# EAGLE design M0FeatherSIC (EAGLE 6.5.0)
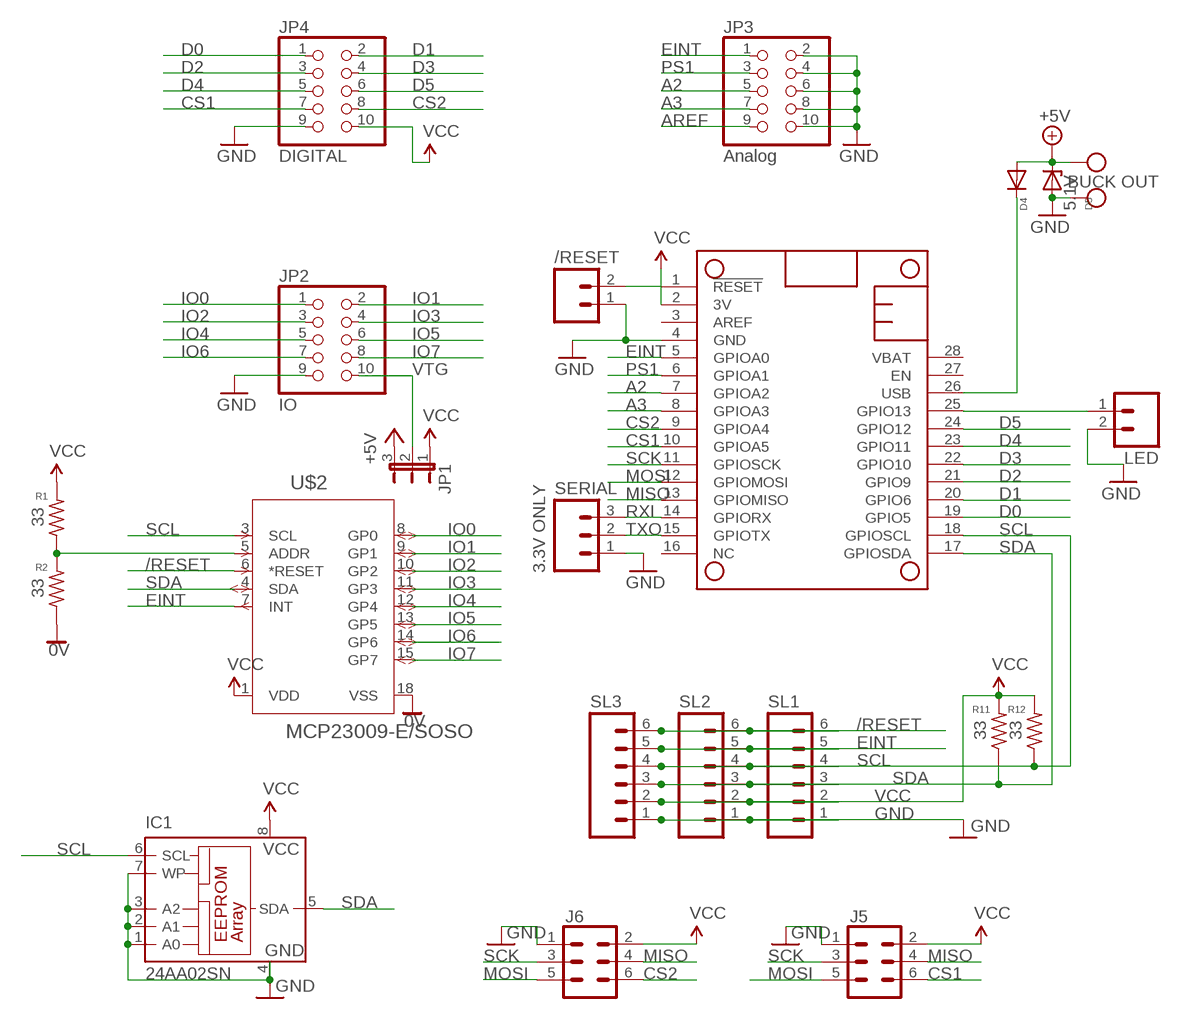
[diagram p0: schematic, sheet 1]

## Parts
/RESET  M02  [02P]
BUCK-OUT  BUCK OUT  W237-102  [W237-102]
D4  1N4148DO35-7  [DO35-7]
D5  5.1V  ZENER-DIODEZD-7.5  [ZDIO-7.5]
IC1  24AA02SN  [SO-08]
J5  CONN_03X2SHROUD  [2X3-SHROUDED]
J6  CONN_03X2SHROUD  [2X3-SHROUDED]
JP1  JP2E  [JP2]
JP2  IO  PINHD-2X5  [2X05]
JP3  Analog  PINHD-2X5  [2X05]
JP4  DIGITAL  PINHD-2X5  [2X05]
LED  M02  [02P]
MS1  FEATHERWING_NODIM  [FEATHERWING_DIM]
R1  33  R-US_R0603  [R0603]
R2  33  R-US_R0603  [R0603]
R11  33  R-US_R0603  [R0603]
R12  33  R-US_R0603  [R0603]
SERIAL  3.3V ONLY  M03  [03P]
SL1  M06  [06P]
SL2  M06  [06P]
SL3  M06  [06P]
U$2  MCP23009-E/SOSO  [SOIC18-W_MC]

## Nets
0V: R2.1 U$2.18(VSS)
+5V: BUCK-OUT.1 D4.A D5.C JP1.3
/RESET: /RESET.2 MS1.1(!RESET) SL1.6 SL2.6 SL3.6 U$2.6(*RESET)
A2: JP3.5 MS1.7(GPIOA2)
A3: JP3.7 MS1.8(GPIOA3)
AREF: JP3.9
CS1: J5.6 JP4.7 MS1.10(GPIOA5)
CS2: J6.6 JP4.8 MS1.9(GPIOA4)
D0: JP4.1 MS1.19(GPIO5)
D1: JP4.2 MS1.20(GPIO6)
D2: JP4.3 MS1.21(GPIO9)
D3: JP4.4 MS1.22(GPIO10)
D4: JP4.5 MS1.23(GPIO11)
D5: JP4.6 MS1.24(GPIO12)
EINT: JP3.1 MS1.5(GPIOA0) SL1.5 SL2.5 SL3.5 U$2.7(INT)
GND: /RESET.1 BUCK-OUT.2 D5.A IC1.1(A0) IC1.2(A1) IC1.3(A2) IC1.4(GND) IC1.7(WP) J5.1 J6.1 JP2.9 JP3.2 JP3.4 JP3.6 JP3.8 JP3.10 JP4.9 LED.2 MS1.4(GND) SERIAL.1 SL1.1 SL2.1 SL3.1
IO0: JP2.1 U$2.8(GP0)
IO1: JP2.2 U$2.9(GP1)
IO2: JP2.3 U$2.10(GP2)
IO3: JP2.4 U$2.11(GP3)
IO4: JP2.5 U$2.12(GP4)
IO5: JP2.6 U$2.13(GP5)
IO6: JP2.7 U$2.14(GP6)
IO7: JP2.8 U$2.15(GP7)
MISO: J5.4 J6.4 MS1.13(GPIOMISO)
MOSI: J5.5 J6.5 MS1.12(GPIOMOSI)
N$1: LED.1 MS1.25(GPIO13)
N$9: R1.1 R2.2 U$2.5(ADDR)
PS1: JP3.3 MS1.6(GPIOA1)
RXI: MS1.14(GPIORX) SERIAL.3
SCK: J5.3 J6.3 MS1.11(GPIOSCK)
SCL: IC1.6(SCL) MS1.18(GPIOSCL) R12.1 SL1.4 SL2.4 SL3.4 U$2.3(SCL)
SDA: IC1.5(SDA) MS1.17(GPIOSDA) R11.1 SL1.3 SL2.3 SL3.3 U$2.4(SDA)
TXO: MS1.15(GPIOTX) SERIAL.2
USB: D4.C MS1.26(USB)
VCC: IC1.8(VCC) J5.2 J6.2 JP1.1 JP4.10 MS1.2(3V) R1.2 R11.2 R12.2 SL1.2 SL2.2 SL3.2 U$2.1(VDD)
VTG: JP1.2 JP2.10
Unconnected: MS1.3(AREF) MS1.16(NC) MS1.27(EN) MS1.28(VBAT) U$2.2(NC_2) U$2.16(NC_3) U$2.17(NC)

## Library data of the parts
/RESET LED = con-amp-quick:M02: AMP QUICK CONNECTOR; OC_FARNELL: unknown; OC_NEWARK: unknown
BUCK-OUT = con-wago-500:W237-102: WAGO SCREW CLAMP; MPN: 237-102; OC_FARNELL: unknown; OC_NEWARK: 70K9898
D4 = diode:1N4148: DIODE high speed (Philips)
D5 = diode:ZENER-DIODE: Z-Diode
IC1 = microchip:24*: Serial EEPROM I2C; MPN: 24AA02/SN; OC_FARNELL: 1331272; OC_NEWARK: 89C9793
J5 J6 = SparkFun-Connectors:CONN_03X2: Multi connection point. Often used as Generic Header-pin footprint for 0.1 inch spaced/style header connections You can populate with any combo of single row headers, but if you'd like an exact match, check these: Header - 2x3 (Male, 0.1") <https://www.sparkfun.com/products/12807> (PRT-12807) Header - 2x3 (Female, 0.1") <https://www.sparkfun.com/products/13010> (PRT-13010) 2x3 Pin Shrouded Header <https://www.sparkfun.com/products/10877> (PRT-10877) On any of the 0.1 inch spaced packages, you can populate with these: Break Away Headers - Straight <https://www.sparkfun.com/products/116> (PRT-00116) Break Away Male Headers - Right Angle <https://www.sparkfun.com/products/553> (PRT-00553) Female Headers <https://www.sparkfun.com/products/115> (PRT-00115) Break Away Headers - Machine Pin <https://www.sparkfun.com/products/117> (PRT-00117) Break Away Female Headers - Swiss Machine Pin <https://www.sparkfun.com/products/743> (PRT-00743) Special note: the shrouded connector mates well with our 3x2 ribbon cables: Ribbon Crimp Connector - 6-pin (2x3, Female) <https://www.sparkfun.com/products/10651> (PRT-10651) Ribbon Cable - 6 wire (15ft) <https://www.sparkfun.com/products/10646> (PRT-10646); PROD_ID: CONN-10681; SF_ID: PRT_10877
JP1 = jumper:JP2E: JUMPER
JP2-JP4 = pinhead:PINHD-2X5: PIN HEADER
MS1 = microbuilder:FEATHERWING
R1 R2 R11 R12 = resistor:R-US_: RESISTOR, American symbol
SERIAL = con-amp-quick:M03: AMP QUICK CONNECTOR; OC_FARNELL: unknown; OC_NEWARK: unknown
SL1-SL3 = con-amp-quick:M06: AMP QUICK CONNECTOR; OC_FARNELL: unknown; OC_NEWARK: unknown
U$2 = sd2016:MCP23009-E/SO; COPYRIGHT: Copyright C 2015 Accelerated Designs. All rights reserved; MANUFACTURER_PART_NUMBER: MCP23009ESO; VENDOR: Microchip

## Net classes
2 gnd: width 0.305 mm, drill 0.711 mm, clearance 0.203 mm

## Board
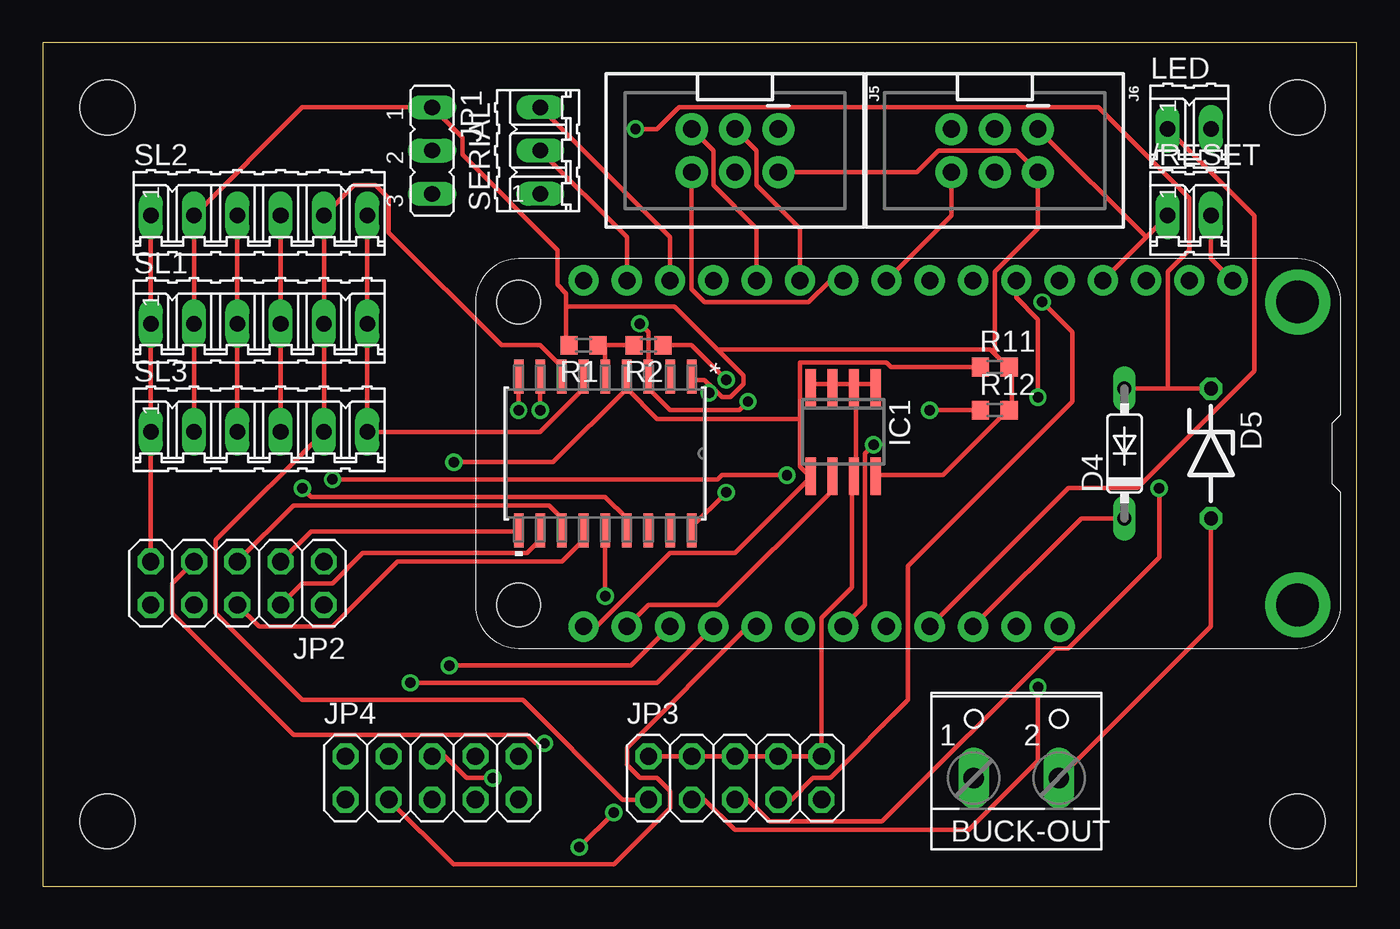
[diagram p1: board, top side]
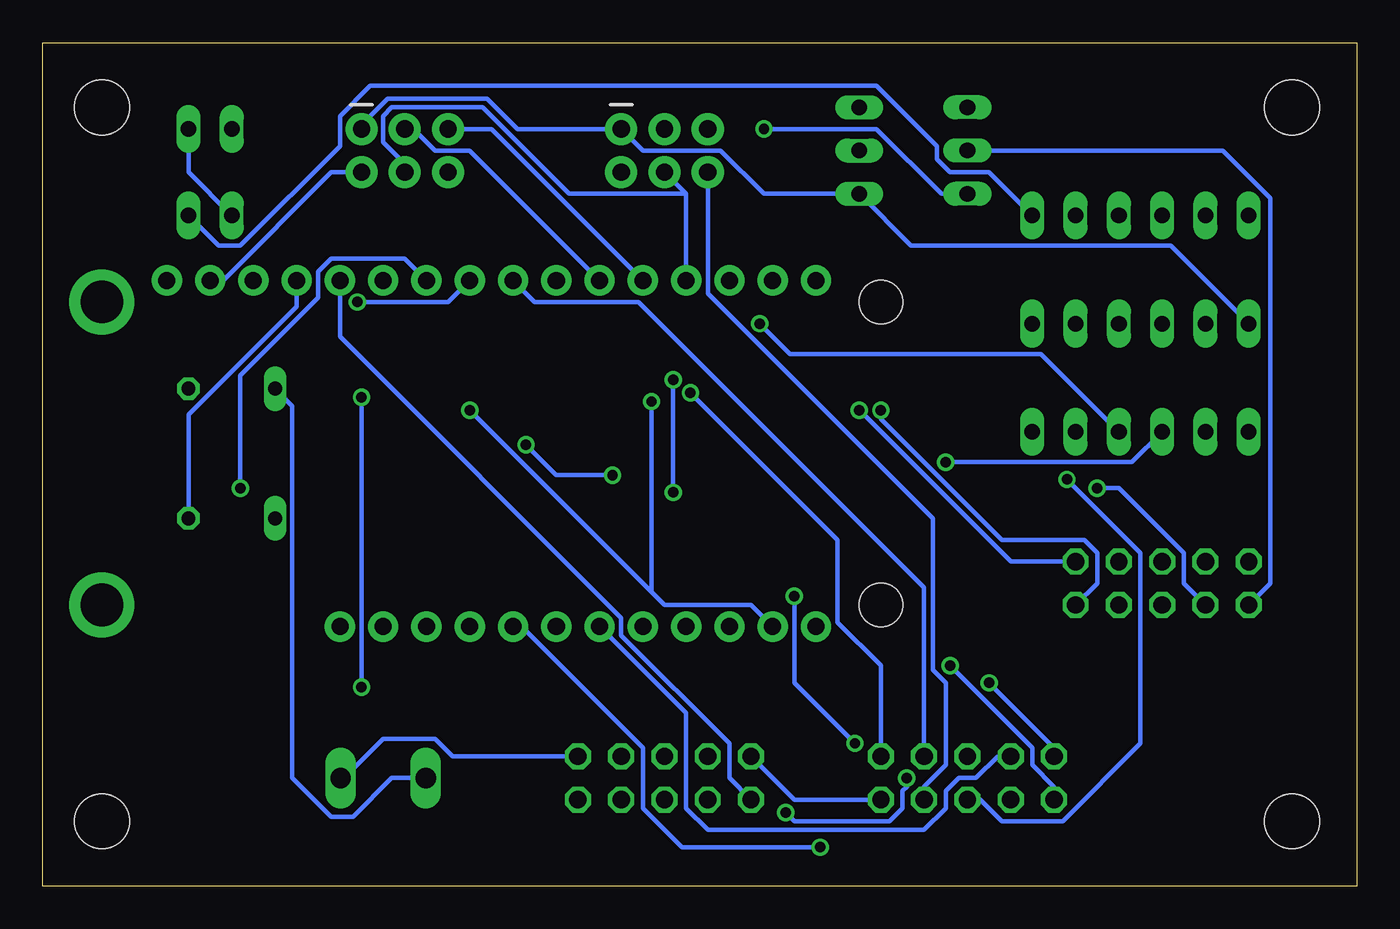
[diagram p2: board, bottom side, seen from below]

Size 77.14 x 49.52 mm. Coordinates in mm from the lower left corner, seen from the top.
Outline: 0,0 77.14,0 77.14,49.52 0,49.52 0,0
Copper layers (1*16): Top 0.035mm / dielectric 1.5mm / Bottom 0.035mm
Design rules "default": minimum track width 10mil, minimum drill 24mil, track to track 8mil, track to pad 8mil, pad to pad 8mil, via to via 8mil, smd to smd 8mil, copper to edge 40mil, drill to drill 8mil, minimum pad ring 10mil, minimum via ring 8mil, stop-mask expansion 4mil, vias tented up to drill 0mil, thermal gap 10mil
Holes 3.2 mm at 3.81,45.72 3.81,3.81 73.66,3.81 73.66,45.72

### Footprints (pad centres in the part's own frame; a part is rotated, then mirrored left to right if it is on the bottom)
02P = drill 0.914 long: 1 -1.27,0; 2 1.27,0
W237-102 = drill 1.194 long: 1 -2.5,-1.27; 2 2.5,-1.27
DO35-7 = drill 0.813 long: A 3.81,0; C -3.81,0
ZDIO-7.5 = drill 0.813 octagon: A 3.81,0; C -3.81,0
SO-08 = smd 0.6 x 2.2: 1 -1.905,-2.6; 2 -0.635,-2.6; 3 0.635,-2.6; 4 1.905,-2.6; 5 1.905,2.6; 6 0.635,2.6; 7 -0.635,2.6; 8 -1.905,2.6
2X3-SHROUDED = drill 1.016 pad 1.88: 1 -1.27,2.54; 2 1.27,2.54; 3 -1.27,0; 4 1.27,0; 5 -1.27,-2.54; 6 1.27,-2.54
JP2 = drill 0.914 long: 1 -2.54,0; 2 0,0; 3 2.54,0
2X05 = drill 1.016 octagon: 1 -5.08,-1.27; 2 -5.08,1.27; 3 -2.54,-1.27; 4 -2.54,1.27; 5 0,-1.27; 6 0,1.27; 7 2.54,-1.27; 8 2.54,1.27; 9 5.08,-1.27; 10 5.08,1.27
FEATHERWING_DIM = drill 1 pad 1.778: 1 6.35,1.27; 2 8.89,1.27; 3 11.43,1.27; 4 13.97,1.27; 5 16.51,1.27; 6 19.05,1.27; 7 21.59,1.27; 8 24.13,1.27; 9 26.67,1.27; 10 29.21,1.27; 11 31.75,1.27; 12 34.29,1.27; 13 36.83,1.27; 14 39.37,1.27; 15 41.91,1.27; 16 44.45,1.27; 17 44.45,21.59; 18 41.91,21.59; 19 39.37,21.59; 20 36.83,21.59; 21 34.29,21.59; 22 31.75,21.59; 23 29.21,21.59; 24 26.67,21.59; 25 24.13,21.59; 26 21.59,21.59; 27 19.05,21.59; 28 16.51,21.59 | drill 2.5 pad 3.81: P$1 2.54,20.32; P$2 2.54,2.54 | hole 2.54: 48.26,20.32; 48.26,2.54
R0603 = smd 1 x 1.1: 1 -0.85,0; 2 0.85,0
03P = drill 0.914 long: 1 -2.54,0; 2 0,0; 3 2.54,0
06P = drill 0.914 long: 1 -6.35,0; 2 -3.81,0; 3 -1.27,0; 4 1.27,0; 5 3.81,0; 6 6.35,0
SOIC18-W_MC = smd 1.981 x 0.559: 1 -4.521,5.08; 2 -4.521,3.81; 3 -4.521,2.54; 4 -4.521,1.27; 5 -4.521,0; 6 -4.521,-1.27; 7 -4.521,-2.54; 8 -4.521,-3.81; 9 -4.521,-5.08; 10 4.521,-5.08; 11 4.521,-3.81; 12 4.521,-2.54; 13 4.521,-1.27; 14 4.521,0; 15 4.521,1.27; 16 4.521,2.54; 17 4.521,3.81; 18 4.521,5.08

### Placement (x,y rotation side)
/RESET  67.31,39.37 0 top
BUCK-OUT  57.15,7.62 0 top
D4  63.5,25.4 90 top
D5  68.58,25.4 270 top
IC1  46.99,26.67 180 top
J5  40.64,43.18 270 top
J6  55.88,43.18 270 top
JP1  22.86,43.18 270 top
JP2  11.43,17.78 180 top
JP3  40.64,6.35 0 top
JP4  22.86,6.35 0 top
LED  67.31,44.45 0 top
MS1  76.2,36.83 180 top
R1  31.75,31.75 180 top
R2  35.56,31.75 180 top
R11  55.88,30.48 0 top
R12  55.88,27.94 0 top
SERIAL  29.21,43.18 90 top
SL1  12.7,33.02 0 top
SL2  12.7,39.37 0 top
SL3  12.7,26.67 0 top
U$2  33.02,25.4 270 top

### Tracks (layer width: path | path; a pad name or v marks a point on that pad's centre or on a via)
0V  (via drill 0.61)
  Top 0.254: R2.1 38.1,31.75 v40.13,29.72 | v40.13,23.11 38.1,21.08 U$2.18
  Bottom 0.254: v40.13,23.11 v40.13,29.72
+5V  (via drill 0.61)
  Top 0.254: D5.C 66.04,29.21 | 66.04,29.21 D4.A | v34.8,44.45 36.07,44.45 37.34,45.72 61.98,45.72 67.31,40.39 67.31,37.34 66.04,36.07 66.04,29.21
  Bottom 0.254: JP1.3 24.38,40.64 28.19,44.45 v34.8,44.45 | BUCK-OUT.1 56.64,6.35 58.93,4.06 60.2,4.06 62.48,6.35 62.48,28.19 D4.A
/RESET
  Top 0.254: U$2.6 31.75,29.21 29.21,26.67 SL3.6 SL1.6 SL2.6 | /RESET.2 68.58,36.83 MS1.1
  Bottom 0.254: /RESET.2 66.8,37.59 65.53,37.59 59.69,43.43 59.69,45.21 57.91,46.99 28.19,46.99 24.64,43.43 24.64,42.67 23.88,41.91 21.59,41.91 SL2.6
A2  (via drill 0.61)
  Top 0.254: JP3.5 41.4,5.08 42.67,3.81 49.28,3.81 59.44,13.97 60.2,13.97 65.53,19.3 v65.53,23.37
  Bottom 0.254: v65.53,23.37 65.53,29.97 60.96,34.54 60.96,36.07 60.2,36.83 55.88,36.83 MS1.7
A3  (via drill 0.61)
  Top 0.254: JP3.7 43.94,5.08 45.21,6.35 46.23,6.35 50.8,10.92 50.8,18.8 60.45,28.45 60.45,32.51 v58.67,34.29
  Bottom 0.254: v58.67,34.29 53.34,34.29 MS1.8
CS1
  Top 0.254: MS1.10 46.23,35.56 44.96,34.29 38.86,34.29 38.1,35.05 J5.6
  Bottom 0.254: JP4.7 25.4,5.84 24.13,7.11 24.13,11.94 24.89,12.7 24.89,21.59 38.1,34.8 J5.6
CS2
  Top 0.254: J6.6 53.34,39.37 MS1.9
  Bottom 0.254: JP4.8 25.4,17.53 42.16,34.29 48.26,34.29 MS1.9
D0  (via drill 0.61)
  Top 0.254: v23.88,12.95 34.54,12.95 MS1.19
  Bottom 0.254: JP4.1 17.78,5.84 19.05,7.11 19.05,8.13 v23.88,12.95
D1  (via drill 0.61)
  Top 0.254: v21.59,11.94 36.07,11.94 MS1.20
  Bottom 0.254: JP4.2 17.78,8.13 v21.59,11.94
D2
  Top 0.254: JP4.3 24.13,1.27 33.53,1.27 36.83,4.57 36.83,5.59 36.07,6.35 35.05,6.35 34.29,7.11 34.29,8.13 41.4,15.24 MS1.21
D3
  Bottom 0.254: JP4.4 21.08,7.62 22.35,6.35 23.37,6.35 24.13,5.59 24.13,4.57 25.4,3.3 38.1,3.3 39.37,4.57 39.37,10.16 MS1.22
D4  (via drill 0.61)
  Top 0.254: v17.02,23.88 39.62,23.88 39.88,24.13 v43.69,24.13 | v48.77,25.91 48.26,25.4 48.26,16.51 MS1.23
  Bottom 0.254: JP4.5 22.1,5.08 20.83,3.81 17.27,3.81 12.7,8.38 12.7,19.56 v17.02,23.88 | v43.69,24.13 46.99,24.13 v48.77,25.91
D5  (via drill 0.61)
  Top 0.254: JP4.6 23.62,7.62 24.89,6.35 v26.42,6.35 | v31.5,2.29 v33.53,4.32
  Bottom 0.254: v26.42,6.35 26.42,5.84 26.67,5.59 26.67,4.57 27.43,3.81 33.02,3.81 v33.53,4.32 | v31.5,2.29 39.62,2.29 41.91,4.57 41.91,8.13 49.02,15.24 MS1.24
EINT
  Top 0.254: U$2.7 30.48,30.48 29.21,31.75 26.92,31.75 20.32,38.35 20.32,40.39 19.56,41.15 18.29,41.15 SL2.5 SL1.5 SL3.5 10.16,20.32 10.16,16 15.24,10.92 28.19,10.92 34.04,5.08 JP3.1
  Bottom 0.254: MS1.5 59.69,32.26 43.18,15.75 43.18,14.73 36.83,8.38 36.83,6.35 JP3.1
GND
  Top 0.254: IC1.4 45.21,29.46 46.23,29.46 IC1.3 46.48,29.46 47.5,29.46 IC1.2 | IC1.2 47.75,29.21 47.75,24.13 IC1.7 47.5,23.88 47.5,17.53 45.72,15.75 JP3.10 JP3.8 JP3.6 JP3.4 JP3.2 | IC1.1 48.77,29.46 47.75,29.46 IC1.2 | D5.A 68.58,15.24 59.69,6.35 BUCK-OUT.2 | SL2.1 SL1.1 SL3.1 JP2.9 | MS1.4 64.77,38.1 | 64.77,38.1 /RESET.1 | 64.77,38.1 J6.1
  Bottom 0.254: JP4.9 33.02,5.08 JP3.2 | LED.2 68.58,41.91 /RESET.1 | J6.1 58.42,44.7 56.9,46.23 51.05,46.23 49.28,44.45 J5.1 41.91,43.18 37.34,43.18 34.8,40.64 SERIAL.1 26.16,37.59 10.92,37.59 SL1.1 | D5.A 68.58,27.69 62.23,34.04 MS1.4 | JP3.10 53.09,7.62 54.1,8.64 57.15,8.64 59.44,6.35 BUCK-OUT.2
IO0  (via drill 0.61)
  Top 0.254: v29.21,27.94 U$2.8
  Bottom 0.254: v29.21,27.94 20.32,19.05 JP2.1
IO1  (via drill 0.61)
  Top 0.254: v27.94,27.94 U$2.9
  Bottom 0.254: v27.94,27.94 27.94,27.43 20.83,20.32 16,20.32 15.24,19.56 15.24,17.78 JP2.2
IO2
  Top 0.254: JP2.3 15.75,20.83 27.94,20.83 U$2.10
IO3
  Top 0.254: U$2.11 29.21,20.32 28.45,19.56 18.8,19.56 17.02,17.78 15.24,17.78 JP2.4
IO4
  Top 0.254: U$2.12 30.48,21.59 29.72,22.35 14.73,22.35 JP2.5
IO5
  Top 0.254: U$2.13 31.75,20.32 30.48,19.05 20.83,19.05 17.02,15.24 12.7,15.24 JP2.6
IO6  (via drill 0.61)
  Top 0.254: v33.02,17.02 U$2.14 | v29.46,8.38 28.96,8.38 28.45,8.89 14.73,8.89 7.62,16 7.62,17.78 JP2.7
  Bottom 0.254: v33.02,17.02 33.02,11.94 v29.46,8.38
IO7  (via drill 0.61)
  Top 0.254: U$2.15 34.29,21.59 33.02,22.86 15.75,22.86 v15.24,23.37
  Bottom 0.254: v15.24,23.37 13.97,23.37 10.16,19.56 10.16,17.78 JP2.8
MISO
  Bottom 0.254: 39.37,40.64 MS1.13 | J5.4 39.37,40.64 | J6.4 55.88,42.42 57.15,43.69 57.15,45.21 56.64,45.72 51.31,45.72 46.23,40.64 39.37,40.64
MOSI
  Top 0.254: MS1.12 41.91,38.61 39.37,41.15 39.37,43.18 J5.5
  Bottom 0.254: J6.5 50.8,44.45 MS1.12
N$1
  Top 0.254: LED.1 71.12,39.37 71.12,30.23 64.26,23.37 60.2,23.37 MS1.25
N$9
  Top 0.254: R2.2 33.02,31.75 | U$2.5 33.02,31.75 | 33.02,31.75 R1.1
PS1  (via drill 0.61)
  Top 0.254: JP3.3 38.86,5.08 40.64,3.3 54.36,3.3 58.42,7.37 v58.42,11.68 | v58.42,28.7 58.42,33.27 57.15,34.54 MS1.6
  Bottom 0.254: v58.42,28.7 v58.42,11.68
RXI
  Top 0.254: SERIAL.3 36.83,38.1 MS1.14
SCK
  Top 0.254: MS1.11 44.45,38.61 41.91,41.15 41.91,43.18 J5.3
  Bottom 0.254: J6.3 55.37,44.45 54.1,43.18 52.07,43.18 MS1.11
SCL  (via drill 0.61)
  Top 0.254: SL3.4 SL1.4 SL2.4 | v52.07,27.94 R12.1 | v41.4,28.45 40.89,27.94 36.83,27.94 35.56,29.21 U$2.3 35.56,32.51 v35.05,33.02 | MS1.18 35.56,16.51 39.62,16.51 46.23,23.11 46.23,23.88 IC1.6
  Bottom 0.254: 41.4,17.27 40.64,16.51 35.56,16.51 MS1.18 | 41.4,17.27 v52.07,27.94 | 41.4,17.27 v41.4,28.45 | SL3.4 18.54,31.24 33.27,31.24 v35.05,33.02
SDA  (via drill 0.61)
  Top 0.254: SL3.3 SL1.3 SL2.3 | R11.1 49.78,30.48 49.53,30.73 44.45,30.73 44.45,27.43 | 44.45,27.43 44.45,24.64 44.96,24.13 IC1.5 44.96,23.88 40.64,19.56 36.83,19.56 32.51,15.24 MS1.17 | 34.29,29.21 U$2.4 34.29,29.72 | 34.29,29.21 36.07,27.43 44.45,27.43 | v24.13,24.89 29.97,24.89 34.29,29.21
  Bottom 0.254: SL3.3 13.21,24.89 v24.13,24.89
TXO
  Top 0.254: SERIAL.2 34.29,38.1 MS1.15
USB
  Top 0.254: D4.C 60.96,21.59 MS1.26
VCC  (via drill 0.61)
  Top 0.254: J5.2 51.31,41.91 52.58,43.18 57.15,43.18 J6.2 58.42,38.61 55.88,36.07 55.88,31.24 | SL3.2 SL1.2 SL2.2 15.24,45.72 JP1.1 24.64,43.94 24.64,42.93 30.23,37.34 30.23,35.31 30.73,34.8 30.73,34.04 | IC1.8 49.02,24.13 52.83,24.13 56.64,27.94 R12.2 56.9,27.94 56.9,30.48 R11.2 56.64,30.48 55.88,31.24 | 30.73,34.04 30.73,31.75 R1.2 | 39.37,29.21 39.88,28.7 40.39,28.7 41.15,29.46 41.15,29.97 39.62,31.5 | 39.37,29.21 38.86,29.72 38.1,29.72 U$2.1 | 39.62,31.5 37.08,34.04 30.73,34.04 | 39.37,29.21 v39.12,28.96 | 55.88,31.24 55.63,31.5 39.62,31.5
  Bottom 0.254: MS1.2 66.55,35.56 60.2,41.91 J6.2 | JP4.10 27.94,12.95 30.48,15.49 30.48,20.32 v39.12,28.96
VTG
  Bottom 0.254: JP1.2 7.87,43.18 5.08,40.39 5.08,17.78 JP2.10